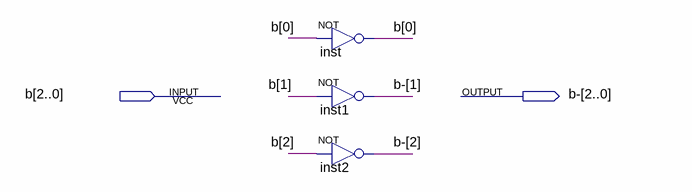
[diagram p0: schematic sheet]
// Quartus schematic not3.bdf as structural Verilog: 3 symbols, 2 pins
module not3 (
  input  [2:0] b,
  output [2:0] \b- 
);

  not inst (b[0], b[0]);
  not inst1 (\b- [1], b[1]);
  not inst2 (\b- [2], b[2]);
endmodule
